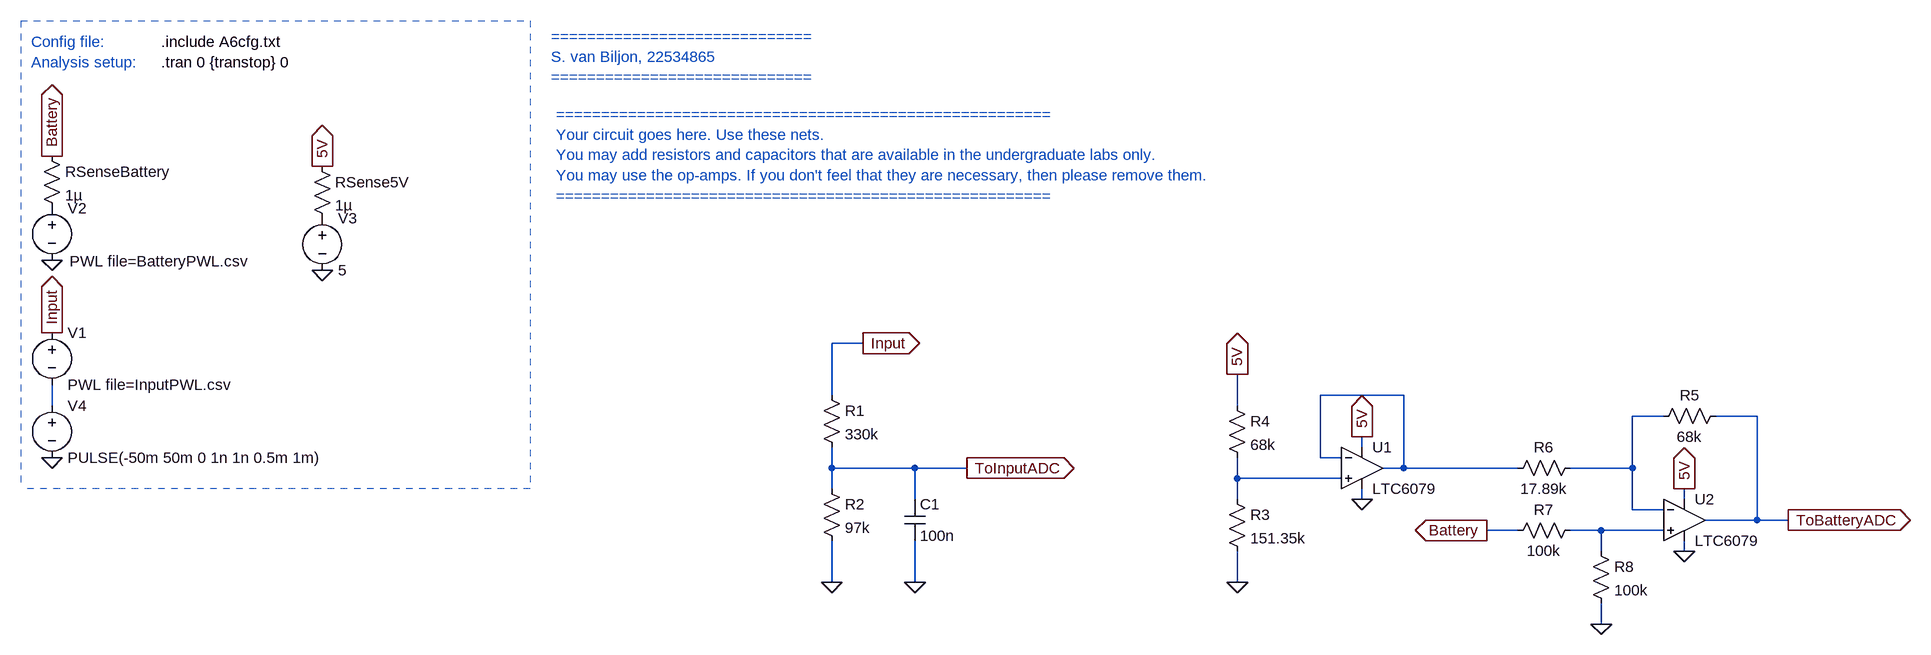
[diagram p0: schematic E344_22534865_A6.asc]
E344_22534865_A6.asc, the LTspice schematic file:
Version 4
SHEET 1 1824 680
WIRE -1072 -928 -1120 -928
WIRE -1120 -848 -1120 -928
WIRE -240 -848 -368 -848
WIRE -2320 -832 -2320 -864
WIRE -496 -832 -496 -880
WIRE 160 -816 112 -816
WIRE 304 -816 240 -816
WIRE -304 -768 -304 -784
WIRE -368 -752 -368 -848
WIRE -336 -752 -368 -752
WIRE -1120 -736 -1120 -768
WIRE -992 -736 -1120 -736
WIRE -912 -736 -992 -736
WIRE -240 -736 -240 -848
WIRE -240 -736 -272 -736
WIRE -64 -736 -240 -736
WIRE 112 -736 112 -816
WIRE 112 -736 16 -736
WIRE -496 -720 -496 -752
WIRE -336 -720 -496 -720
WIRE -1120 -704 -1120 -736
WIRE -992 -688 -992 -736
WIRE -496 -688 -496 -720
WIRE -304 -688 -304 -704
WIRE 192 -688 192 -704
WIRE 112 -672 112 -736
WIRE 160 -672 112 -672
WIRE 304 -656 304 -816
WIRE 304 -656 224 -656
WIRE 352 -656 304 -656
WIRE -64 -640 -112 -640
WIRE 64 -640 16 -640
WIRE 160 -640 64 -640
WIRE 64 -608 64 -640
WIRE 192 -608 192 -624
WIRE -1120 -560 -1120 -624
WIRE -992 -560 -992 -624
WIRE -496 -560 -496 -608
WIRE 64 -496 64 -528
FLAG -2320 -944 Input
IOPIN -2320 -944 Out
FLAG -1904 -1040 0
FLAG -2320 -752 0
FLAG -2320 -1056 0
FLAG -912 -736 ToInputADC
IOPIN -912 -736 Out
FLAG 352 -656 ToBatteryADC
IOPIN 352 -656 Out
FLAG -1904 -1200 5V
IOPIN -1904 -1200 Out
FLAG -2320 -1216 Battery
IOPIN -2320 -1216 Out
FLAG -112 -640 Battery
IOPIN -112 -640 Out
FLAG -1072 -928 Input
IOPIN -1072 -928 Out
FLAG -304 -784 5V
IOPIN -304 -784 Out
FLAG -1120 -560 0
FLAG -992 -560 0
FLAG 192 -608 0
FLAG 192 -704 5V
IOPIN 192 -704 Out
FLAG -496 -880 5V
IOPIN -496 -880 Out
FLAG -304 -688 0
FLAG -496 -560 0
FLAG 64 -496 0
SYMBOL voltage -2320 -960 R0
WINDOW 123 0 0 Left 0
WINDOW 39 0 0 Left 0
SYMATTR InstName V1
SYMATTR Value PWL file=InputPWL.csv
SYMBOL voltage -2320 -1152 R0
WINDOW 123 0 0 Left 0
WINDOW 39 0 0 Left 0
WINDOW 3 27 98 Left 2
SYMATTR Value PWL file=BatteryPWL.csv
SYMATTR InstName V2
SYMBOL voltage -1904 -1136 R0
WINDOW 123 0 0 Left 0
WINDOW 39 0 0 Left 0
SYMATTR InstName V3
SYMATTR Value 5
SYMBOL voltage -2320 -848 R0
WINDOW 123 0 0 Left 0
WINDOW 39 0 0 Left 0
SYMATTR InstName V4
SYMATTR Value PULSE(-50m 50m 0 1n 1n 0.5m 1m)
SYMBOL res -1920 -1216 R0
SYMATTR InstName RSense5V
SYMATTR Value 1µ
SYMBOL res -2336 -1232 R0
SYMATTR InstName RSenseBattery
SYMATTR Value 1µ
SYMBOL OpAmps\\LTC6079 -304 -736 R0
SYMATTR InstName U1
SYMBOL OpAmps\\LTC6079 192 -656 R0
SYMATTR InstName U2
SYMBOL res -1136 -864 R0
SYMATTR InstName R1
SYMATTR Value 330k
SYMBOL res -1136 -720 R0
SYMATTR InstName R2
SYMATTR Value 97k
SYMBOL cap -1008 -688 R0
SYMATTR InstName C1
SYMATTR Value 100n
SYMBOL res -512 -704 R0
SYMATTR InstName R3
SYMATTR Value 151.35k
SYMBOL res -512 -848 R0
SYMATTR InstName R4
SYMATTR Value 68k
SYMBOL res 256 -832 R90
WINDOW 0 0 56 VBottom 2
WINDOW 3 32 56 VTop 2
SYMATTR InstName R5
SYMATTR Value 68k
SYMBOL res 32 -752 R90
WINDOW 0 0 56 VBottom 2
WINDOW 3 32 56 VTop 2
SYMATTR InstName R6
SYMATTR Value 17.89k
SYMBOL res 32 -656 R90
WINDOW 0 0 56 VBottom 2
WINDOW 3 32 56 VTop 2
SYMATTR InstName R7
SYMATTR Value 100k
SYMBOL res 48 -624 R0
SYMATTR InstName R8
SYMATTR Value 100k
TEXT -2152 -1360 Left 2 !.tran 0 {transtop} 0
TEXT -2152 -1392 Left 2 !.include A6cfg.txt
TEXT -2352 -1392 Left 2 ;Config file:
TEXT -2352 -1360 Left 2 ;Analysis setup:
TEXT -1552 -1400 Left 2 ;=============================\nS. van Biljon, 22534865\n=============================
TEXT -1544 -1280 Left 2 ;=======================================================\nYour circuit goes here. Use these nets.\nYou may add resistors and capacitors that are available in the undergraduate labs only.\nYou may use the op-amps. If you don't feel that they are necessary, then please remove them.\n=======================================================
LINE Normal -1584 -1424 -1584 -704 2
LINE Normal -2368 -1424 -1584 -1424 2
LINE Normal -1584 -704 -2368 -704 2
LINE Normal -1584 -720 -1584 -720 2
LINE Normal -2368 -1424 -2368 -704 2

The netlist it stands for:
* E344_22534865_A6.asc
V1 Input N002 PWL file=InputPWL.csv
V2 P001 0 PWL file=BatteryPWL.csv
V3 P002 0 5
V4 N002 0 PULSE(-50m 50m 0 1n 1n 0.5m 1m)
RSense5V 5V P002 1µ
RSenseBattery Battery P001 1µ
XU1 N004 N001 5V 0 N001 LTC6078  ; LTC6079, pins In+ In- V+ V- OUT
XU2 N005 N003 5V 0 ToBatteryADC LTC6078  ; LTC6079, pins In+ In- V+ V- OUT
R1 Input ToInputADC 330k
R2 ToInputADC 0 97k
C1 ToInputADC 0 100n
R3 N004 0 151.35k
R4 5V N004 68k
R5 ToBatteryADC N003 68k
R6 N003 N001 17.89k
R7 N005 Battery 100k
R8 N005 0 100k
.tran 0 {transtop} 0
.include A6cfg.txt
* Config file:
* Analysis setup:
* =============================
* S. van Biljon, 22534865
* =============================
* =======================================================
* Your circuit goes here. Use these nets.
* You may add resistors and capacitors that are available in the undergraduate labs only.
* You may use the op-amps. If you don't feel that they are necessary, then please remove them.
* =======================================================
.lib LTC5.lib
.backanno
.end